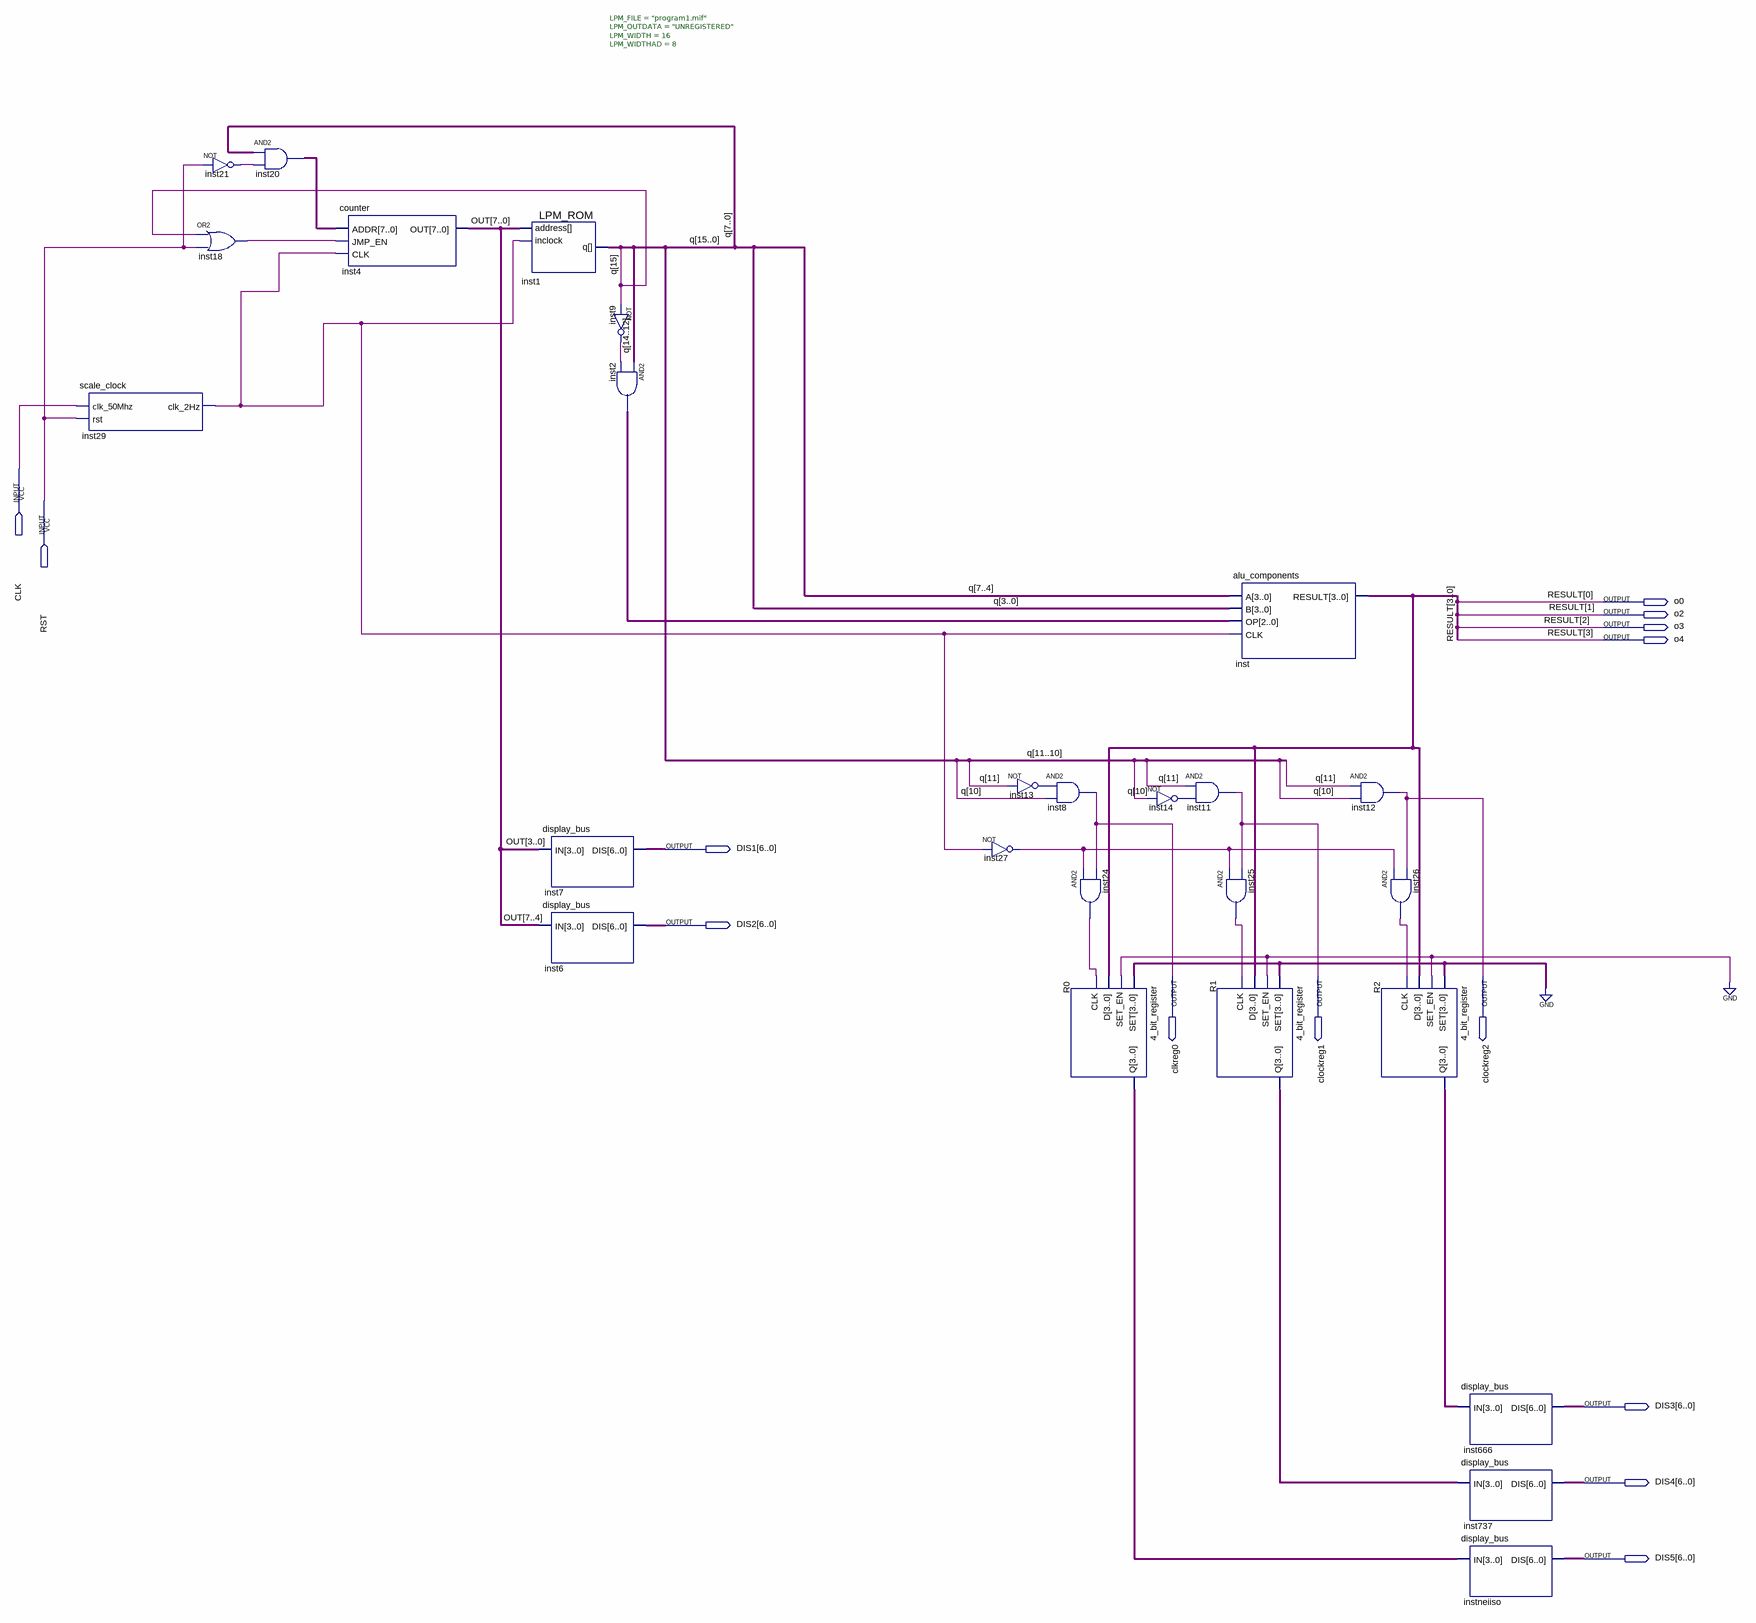
[diagram p0: schematic sheet]
// Quartus schematic CPU_CONTROL_ROM.bdf as structural Verilog: 26 symbols, 14 pins
module CPU_CONTROL_ROM (
  input  CLK,
  input  RST,
  output o0,
  output o2,
  output o3,
  output o4,
  output [6:0] DIS1,
  output [6:0] DIS2,
  output clkreg0,
  output clockreg1,
  output clockreg2,
  output [6:0] DIS3,
  output [6:0] DIS4,
  output [6:0] DIS5
);

  wire inst9_out, inst13_out, inst14_out, inst18_out, inst21_out, inst24_out, inst25_out, inst26_out,
       inst27_out, inst29_clk_2hz;
  wire [2:0] inst2_out;
  wire [3:0] R0_q, R1_q, R2_q;
  wire [7:0] inst20_out, OUT;
  wire [15:0] q;

  scale_clock inst29 (.clk_50Mhz(CLK), .rst(RST), .clk_2Hz(inst29_clk_2hz));
  not inst21 (inst21_out, RST);
  or inst18 (inst18_out, q[15], RST);
  assign inst20_out = q[7:0] & {8{inst21_out}};  // AND2 inst20, 8 bits wide
  counter inst4 (.ADDR(inst20_out), .JMP_EN(inst18_out), .CLK(inst29_clk_2hz), .OUT(OUT));
  LPM_ROM #(.LPM_FILE("program1.mif"), .LPM_OUTDATA("UNREGISTERED"), .LPM_WIDTH(16), .LPM_WIDTHAD(8)) inst1 (
    .address(OUT), .inclock(inst29_clk_2hz), .q(q));
  display_bus inst7 (.IN(OUT[3:0]), .DIS(DIS1));
  display_bus inst6 (.IN(OUT[7:4]), .DIS(DIS2));
  not inst9 (inst9_out, q[15]);
  assign inst2_out = q[14:12] & {3{inst9_out}};  // AND2 inst2, 3 bits wide
  not inst13 (inst13_out, q[11]);
  not inst27 (inst27_out, inst29_clk_2hz);
  and inst8 (clkreg0, inst13_out, q[10]);
  and inst24 (inst24_out, inst27_out, clkreg0);
  \4_bit_register  R0 (.SET(4'b0000), .SET_EN(1'b0), .D({o4, o3, o2, o0}), .CLK(inst24_out), .Q(R0_q));
  not inst14 (inst14_out, q[10]);
  alu_components inst (.A(q[7:4]), .B(q[3:0]), .OP(inst2_out), .CLK(inst29_clk_2hz), .RESULT({o4, o3, o2, o0}));
  and inst11 (clockreg1, q[11], inst14_out);
  and inst25 (inst25_out, inst27_out, clockreg1);
  \4_bit_register  R1 (.SET(4'b0000), .SET_EN(1'b0), .D({o4, o3, o2, o0}), .CLK(inst25_out), .Q(R1_q));
  and inst12 (clockreg2, q[11], q[10]);
  and inst26 (inst26_out, inst27_out, clockreg2);
  \4_bit_register  R2 (.SET(4'b0000), .SET_EN(1'b0), .D({o4, o3, o2, o0}), .CLK(inst26_out), .Q(R2_q));
  display_bus inst666 (.IN(R2_q), .DIS(DIS3));
  display_bus inst737 (.IN(R1_q), .DIS(DIS4));
  display_bus instneiiso (.IN(R0_q), .DIS(DIS5));

  // Other names for the same wires on the sheet: RESULT[3:0] = {o4, o3, o2, o0}
endmodule
